# EAGLE schematic RFsensorNetwork (EAGLE 6.5.0)
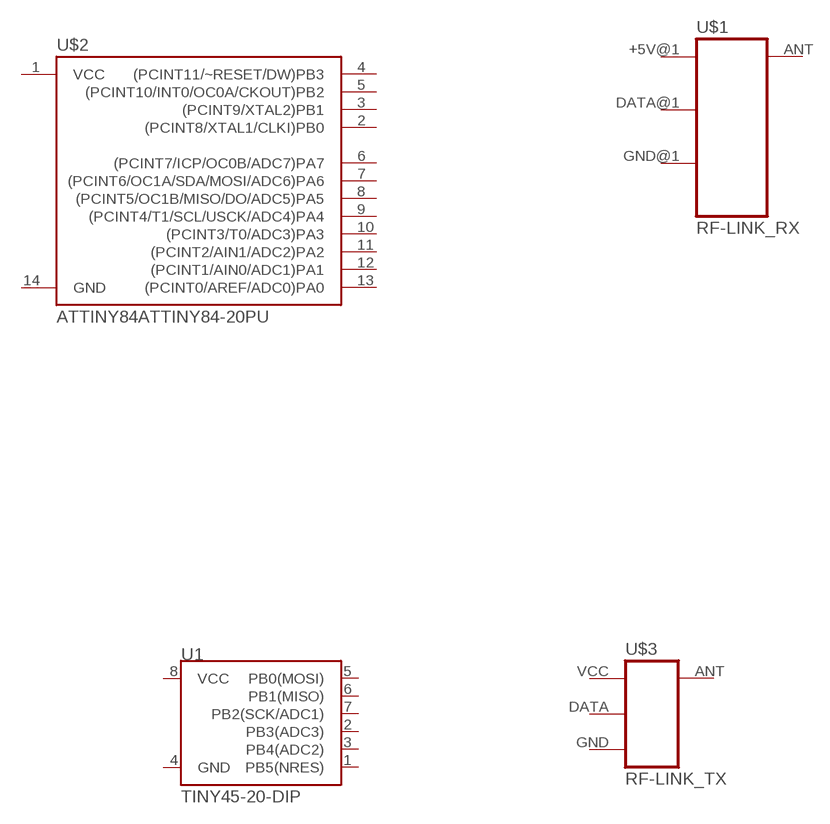
[diagram p0: schematic, sheet 1]

## Parts
U1  TINY45-20-DIP  ATTINY45TINY45-20-DIP  [DIP08]
U$1  RF-LINK_RX  [RF-LINK_RX]
U$2  ATTINY84ATTINY84-20PU  [DIL14]
U$3  RF-LINK_TX  [RF-LINK_TX]
Unconnected: U1.1(PB5(NRES)) U1.2(PB3(ADC3)) U1.3(PB4(ADC2)) U1.4(GND) U1.5(PB0(MOSI)) U1.6(PB1(MISO)) U1.7(PB2(SCK/ADC1)) U1.8(VCC) U$1.ANT U$1.DATA@1(DATA) U$2.1(VCC) U$2.2((PCINT8/XTAL1/CLKI)PB0) U$2.3((PCINT9/XTAL2)PB1) U$2.4((PCINT11/~RESET/DW)PB3) U$2.5((PCINT10/INT0/OC0A/CKOUT)PB2) U$2.6((PCINT7/ICP/OC0B/ADC7)PA7) U$2.7((PCINT6/OC1A/SDA/MOSI/ADC6)PA6) U$2.8((PCINT5/OC1B/MISO/DO/ADC5)PA5) U$2.9((PCINT4/T1/SCL/USCK/ADC4)PA4) U$2.10((PCINT3/T0/ADC3)PA3) U$2.11((PCINT2/AIN1/ADC2)PA2) U$2.12((PCINT1/AIN0/ADC1)PA1) U$2.13((PCINT0/AREF/ADC0)PA0) U$2.14(GND) U$3.ANT U$3.DATA

## Power pins joined to a net without a drawn wire
+5V: U$1.+5V@1(+5V) U$3.VCC(+5V)
GND: U$1.GND@1(GND) U$3.GND

## Library data of the parts
U1 = SparkFun-DigitalIC:ATTINY45: Atmel 8-pin 2/4/8kB flash uC; PROD_ID: IC-09439
U$1 = SparkFun-RF:RF-LINK_RX: RF Link receivers- WRL-8947, 8948, 8949, 8950
U$2 = SparkFun-DigitalIC:ATTINY84: Atmel 14-pin 2/4/8kB flash uC
U$3 = SparkFun-RF:RF-LINK_TX: RF Link transmitters WRL-8945, 8946